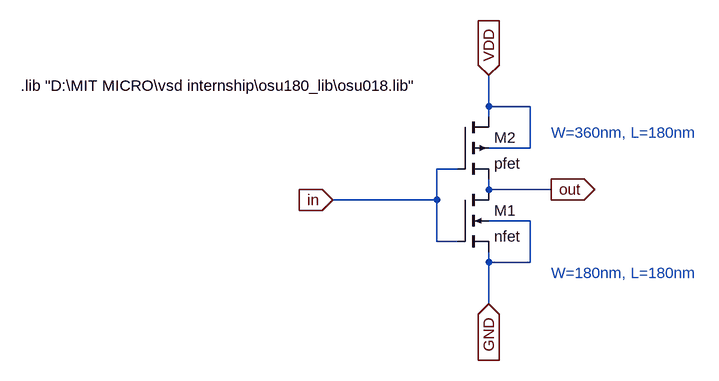
[diagram p0: schematic inv101.asc]
inv101.asc, the LTspice schematic file:
Version 4
SHEET 1 880 680
WIRE 256 48 256 0
WIRE 320 48 256 48
WIRE 256 64 256 48
WIRE 320 112 320 48
WIRE 320 112 256 112
WIRE 208 144 176 144
WIRE 256 176 256 160
WIRE 352 176 256 176
WIRE 176 192 176 144
WIRE 176 192 16 192
WIRE 320 224 256 224
WIRE 176 256 176 192
WIRE 208 256 176 256
WIRE 256 288 256 272
WIRE 320 288 320 224
WIRE 320 288 256 288
WIRE 256 352 256 288
FLAG 352 176 out
IOPIN 352 176 Out
FLAG 16 192 in
IOPIN 16 192 In
FLAG 256 0 VDD
IOPIN 256 0 In
FLAG 256 352 GND
IOPIN 256 352 In
SYMBOL nmos4 208 176 R0
SYMATTR InstName M1
SYMATTR Value2 l=180n w=180n
SYMATTR Value nfet
SYMBOL pmos4 208 64 R0
SYMATTR InstName M2
SYMATTR Value2 l=180n w=360n
SYMATTR Value pfet
TEXT -464 16 Left 2 !.lib "D:\\MIT MICRO\\vsd internship\\osu180_lib\\osu018.lib"
TEXT 352 304 Left 2 ;W=180nm, L=180nm
TEXT 352 88 Left 2 ;W=360nm, L=180nm

The netlist it stands for:
* inv101.asc
M1 out in GND GND nfet l=180n w=180n
M2 VDD in out VDD pfet l=180n w=360n
.model NMOS NMOS
.model PMOS PMOS
.lib standard.mos
.lib "D:\MIT MICRO\vsd internship\osu180_lib\osu018.lib"
* W=180nm, L=180nm
* W=360nm, L=180nm
.backanno
.end